# Altium schematic sheet Sensors.SchDoc
size A4; SheetNumber: 3; SheetTotal: 7
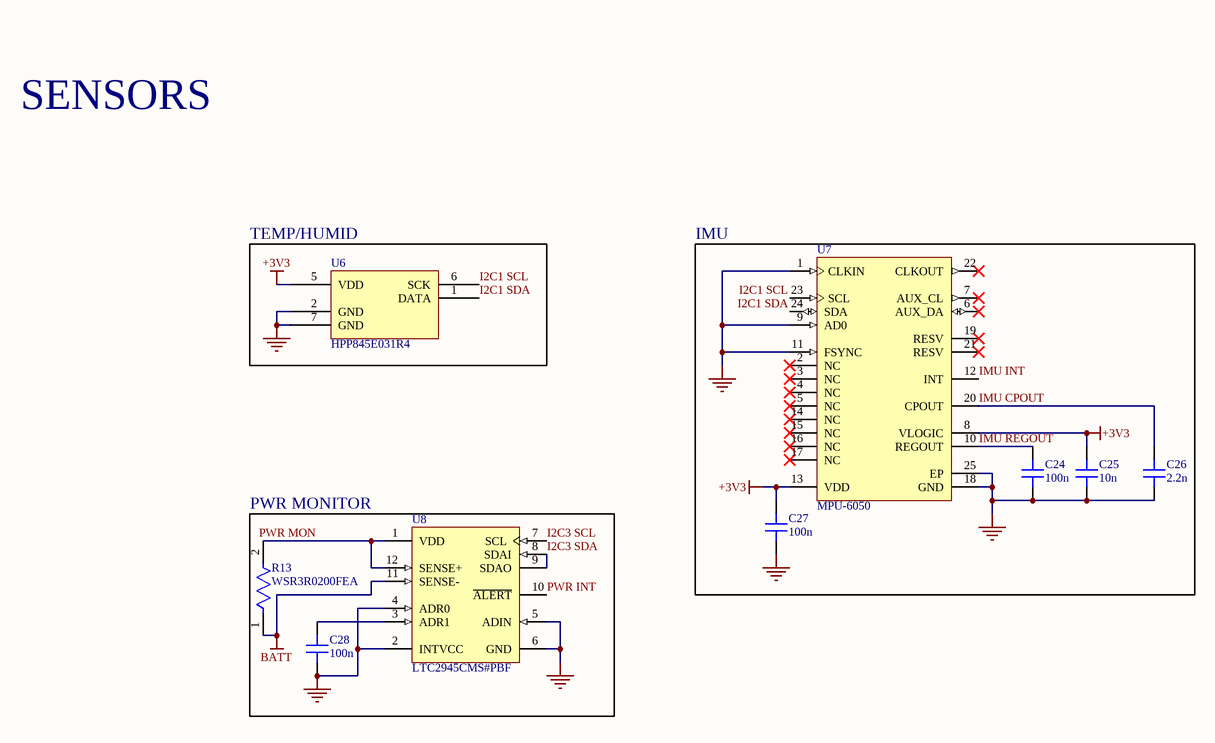
[diagram p0: Sensors.SchDoc]

## Parts
C24  100n  [CAP 0402_1005]
C25  10n  [CAP 0402_1005]
C26  2.2n  [CAP 0402_1005]
C27  100n  [CAP 0402_1005]
C28  100n  [CAP 0402_1005]
R13  WSR3R0200FEA  [FP-WSR3-MFG]
U6  HPP845E031R4  [TE HPP845E031R4]
U7  MPU-6050  [IS-QFN-24_V]
U8  LTC2945CMS#PBF  [LT-MS-12_M]

## Blocks framed on the sheet
TEMP/HUMID: U6
IMU: C24-C27 U7
PWR MONITOR: C28 R13 U8

## Nets
+3V3: C25.2 C27.2 U6.5(VDD) U7.8(VLOGIC) U7.13(VDD)
BATT: R13.1 U8.11(SENSE-)
GND: C24.1 C25.1 C26.1 C27.1 C28.1 U6.2(GND) U6.7(GND) U7.1(CLKIN) U7.9(AD0) U7.11(FSYNC) U7.18(GND) U7.25(EP) U8.2(INTVCC) U8.4(ADR0) U8.5(ADIN) U8.6(GND)
I2C1 SCL: U6.6(SCK) U7.23(SCL)
I2C1 SDA: U6.1(DATA) U7.24(SDA)
I2C3 SCL: U8.7(SCL)
I2C3 SDA: U8.8(SDAI) U8.9(SDAO)
IMU CPOUT: C26.2 U7.20(CPOUT)
IMU INT: U7.12(INT)
IMU REGOUT: C24.2 U7.10(REGOUT)
PWR INT: U8.10(~{ALERT})
PWR MON: R13.2 U8.1(VDD) U8.12(SENSE+)
NetC28_2: C28.2 U8.3(ADR1)

Not connected (* = marked no-connect by the designer): U7 2(NC)* 3(NC)* 4(NC)* 5(NC)* 6(AUX_DA)* 7(AUX_CL)* 14(NC)* 15(NC)* 16(NC)* 17(NC)* 19(RESV)* 21(RESV)* 22(CLKOUT)*

## Notes on the sheet
- SENSORS

## Library data of the parts
C24 C27 C28 = CL05B104KP5VPNC: CAP CER 100NF 10V X7R 0402; Part Number: CL05B104KP5VPNC
C25 = C0402C103J5RECAUTO: CAP CER 0402 10NF 50V X7R 5%; Part Number: C0402C103J5RECAUTO
C26 = C0402C222J3GEC7867: CAP CER 0402 2.2NF 25V C0G 5%; Part Number: C0402C222J3GEC7867
R13 = CMP-00030-39853526-1: WSR3R0200FEA Res Metal Strip 4527 0.02 Ohm 1% 3W ±75ppm/°C Molded SMD SMD Embossed Plastic T/R; Resistance: 20mΩ; Voltage Rating (DC): 240mV; Features: Automotive AEC-Q200, Moisture Resistant; Tolerance: 1%; Radiation Hardening: No; Composition: Metal Element; Width: 6.98mm; Min Operating Temperature: -65°C; Case Code (Imperial): 4527; Schedule B: 8533210045, 8533210045; Height: 2.41mm; Max Power Dissipation: 3W; Military Standard: Not; Contact Plating: Silver, Tin; Lead Free: Lead Free; Power Rating: 3W; Case/Package: 4527; RoHS: Compliant; REACH SVHC: No SVHC; Depth: 6.98mm; Number of Terminations: 2; Temperature Coefficient: 75ppm/°C; NexarPartId: 39853526; Packaging: Cut Tape; Length: 11.56mm; Termination: SMD/SMT; Max Operating Temperature: 275°C
U6 = HPP845E031R4: SENSOR HUMID/TEMP 3V I2C 2% SMD; Part Number: HPP845E031R4
U7 = CMP-1753-00002-2: 3-Axis Gyroscope, Accelerometer and a Digital Motion Processor(TM) (DMP), 2.375 to 3.46 V, -40 to 85 degC, 24-Pin QFN, RoHS, Tape and Reel; Manufacturer: InvenSense; Featured Product: MPU-60506-Axis,IntegratedI²CSolution; Other Names: 1428-1007-2 / MPU6050; Sensor Type: MotionTracking; Online Catalog: MPU-6000™Series; Unit PriceUSD: Digital; Datasheet Version: Rev. 3.3, 05/2012; Category: Sensors,Transducers; Datasheet URL: http://datasheet.octopart.com/MPU-6050-InvenSense-datasheet-14421344.pdf; Family: Multifunction; Standard Package: 5,000; Manufacturer URL: http://www.invensense.com/; Output Type: Digital; Dynamic Catalog: MPU-6000™Series
U8 = CMP-0482-00795-1: Wide Range I2C Power Monitor, 12-pin SOP (MS-12), 0 to 70 degC, Pb-Free; Manufacturer: Linear Technology; Number of Supplies(#): 1; ComponentLink3Description: Package Specification; PackageDescription: 12-Pin Plastic MSOP, Body 4.039 x 3 mm, Pitch 0.65 mm; RoHS: TRUE; ComponentLink1URL: http://www.linear.com/; ComponentLink2Description: Datasheet; PackageVersion: Rev. A, 05/2013; PackageReference: MS-12; ComponentLink3URL: http://cds.linear.com/docs/en/packaging/05081668_A_MS12.pdf; PartNumber: LTC2945CMS#PBF; ComponentLink1Description: Manufacturer URL; ComponentLink2URL: http://cds.linear.com/docs/en/datasheet/2945f.pdf; Mounting Technology: Surface Mount